# EAGLE design zedAF (EAGLE 9.4.2)

## Sheet 1 of 2
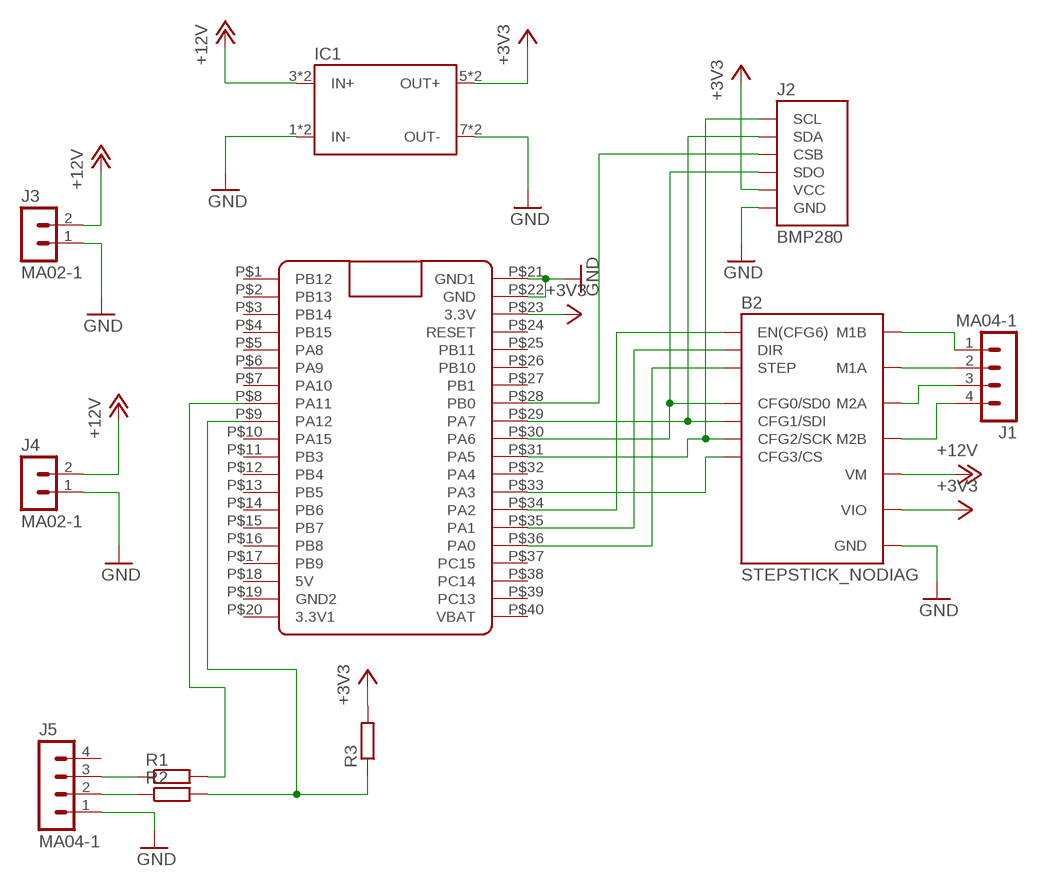
[diagram p0: schematic, sheet 1]

### Parts
B2  STEPSTICK_NODIAG  [STEPSTICK]
IC1  DC/DCDC  [DC/DC]
J1  MA04-1  [MA04-1]
J2  BMP280  [BMP280-1X6]
J3  MA02-1  [MA02-1]
J4  MA02-1  [MA02-1]
J5  MA04-1  [MA04-1]
R1  R-EU_R1206  [R1206]
R2  R-EU_R1206  [R1206]
R3  R-EU_R1206  [R1206]
U$1  BLUE_PILLWIDE  [BLUE_PILL_WIDE]

### Nets
+3V3: B2.VIO IC1.5(OUT+) IC1.6(OUT+) J2.1(VCC) R3.2 U$1.P$23(3.3V)
+12V: B2.VM IC1.3(IN+) IC1.4(IN+) J3.2 J4.2
GND: B2.GND@1(GND) B2.GND@2(GND) IC1.1(IN-) IC1.2(IN-) IC1.7(OUT-) IC1.8(OUT-) J2.2(GND) J3.1 J4.1 J5.1 U$1.P$21(GND1) U$1.P$22(GND)
N$1: B2.M1B J1.1
N$2: B2.M1A J1.2
N$3: B2.M2A J1.3
N$4: B2.M2B J1.4
N$5: B2.CFG1(CFG1/SDI) J2.4(SDA) U$1.P$29(PA7)
N$6: B2.NC/CFG0(CFG0/SD0) J2.6(SDO) U$1.P$30(PA6)
N$7: B2.CFG2(CFG2/SCK) J2.3(SCL) U$1.P$31(PA5)
N$8: B2.CFG3(CFG3/CS) U$1.P$33(PA3)
N$9: B2.EN(EN(CFG6)) U$1.P$34(PA2)
N$10: B2.DIR U$1.P$35(PA1)
N$11: B2.STEP U$1.P$36(PA0)
N$12: J2.5(CSB) U$1.P$28(PB0)
N$13: J5.3 R1.1
N$14: J5.2 R2.1
N$15: R2.2 R3.1 U$1.P$9(PA12)
N$16: R1.2 U$1.P$8(PA11)
Unconnected: J5.4 U$1.P$1(PB12) U$1.P$2(PB13) U$1.P$3(PB14) U$1.P$4(PB15) U$1.P$5(PA8) U$1.P$6(PA9) U$1.P$7(PA10) U$1.P$10(PA15) U$1.P$11(PB3) U$1.P$12(PB4) U$1.P$13(PB5) U$1.P$14(PB6) U$1.P$15(PB7) U$1.P$16(PB8) U$1.P$17(PB9) U$1.P$18(5V) U$1.P$19(GND2) U$1.P$20(3.3V1) U$1.P$24(RESET) U$1.P$25(PB11) U$1.P$26(PB10) U$1.P$27(PB1) U$1.P$32(PA4) U$1.P$37(PC15) U$1.P$38(PC14) U$1.P$39(PC13) U$1.P$40(VBAT)

## Sheet 2 of 2

## Library data of the parts
B2 = we-board:STEPSTICK_NODIAG: SilentStepStick - Trinamic TMC2100/TMC2130 Stepper Motor Driver TMC2100 - CFG pins for configuration TMC2130 - SPI for configuration Pin CFG0/SDO only available on TMC2130 SilentStepStick.
IC1 = we-power:DC/DC: DC/DC Converter from Meanwell / Recom
J1 J5 = we-con:MA04-1: Pin Header
J2 = we-board:BMP280: AVR ISP connector
J3 J4 = we-con:MA02-1: Pin Header
R1-R3 = rcl:R-EU_: RESISTOR, European symbol; SPICEPREFIX: R
U$1 = BluePill:BLUE_PILL

## Board
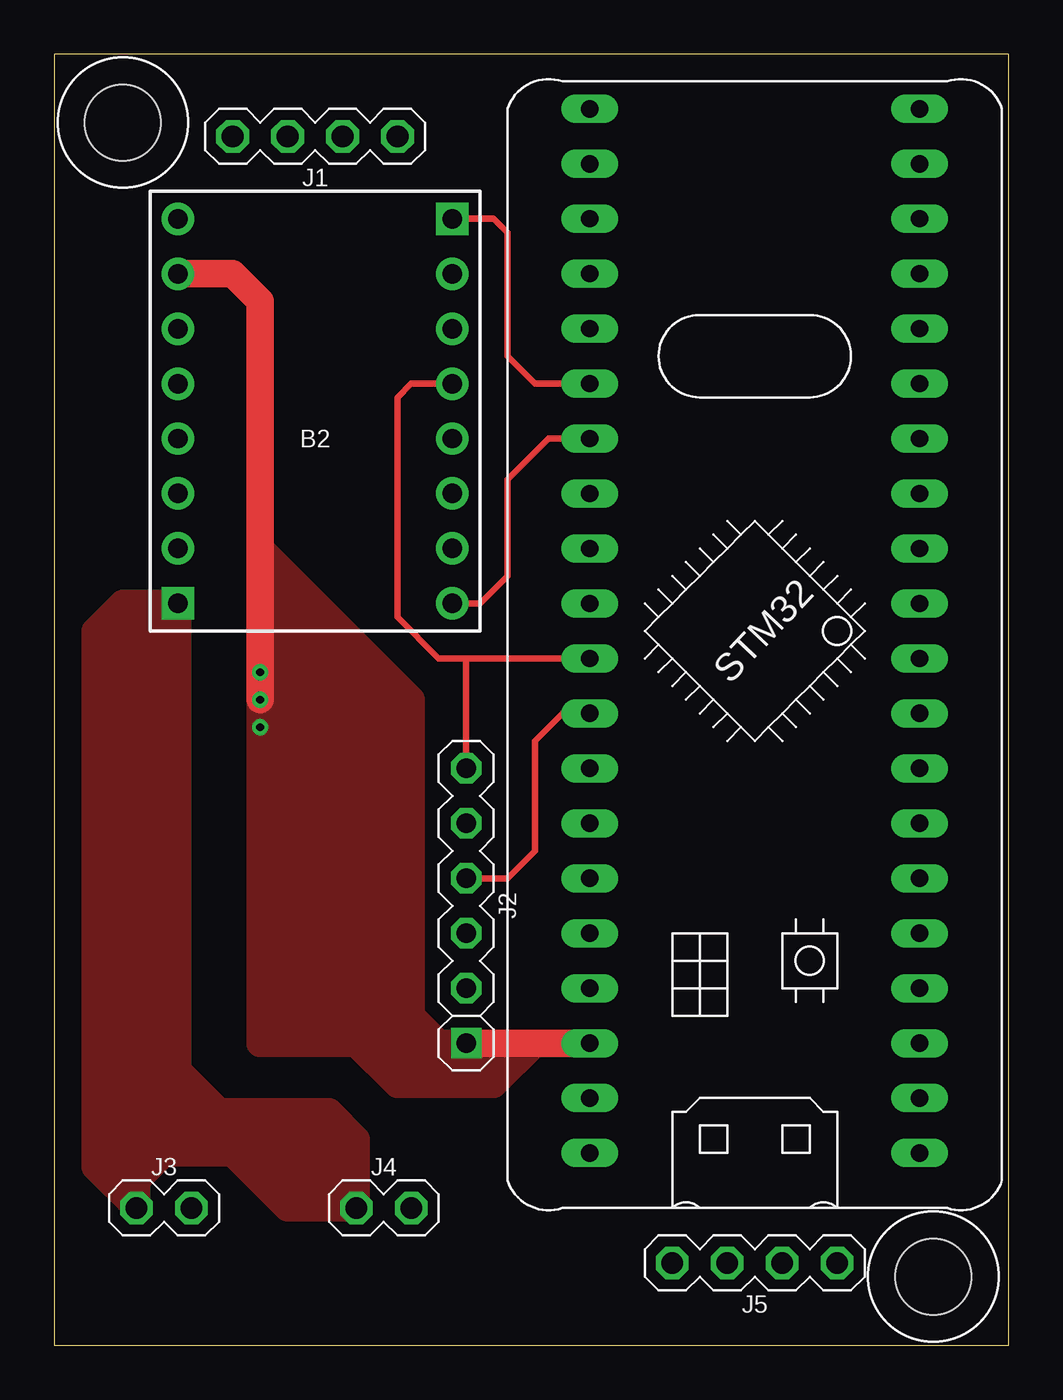
[diagram p1: board, top side]
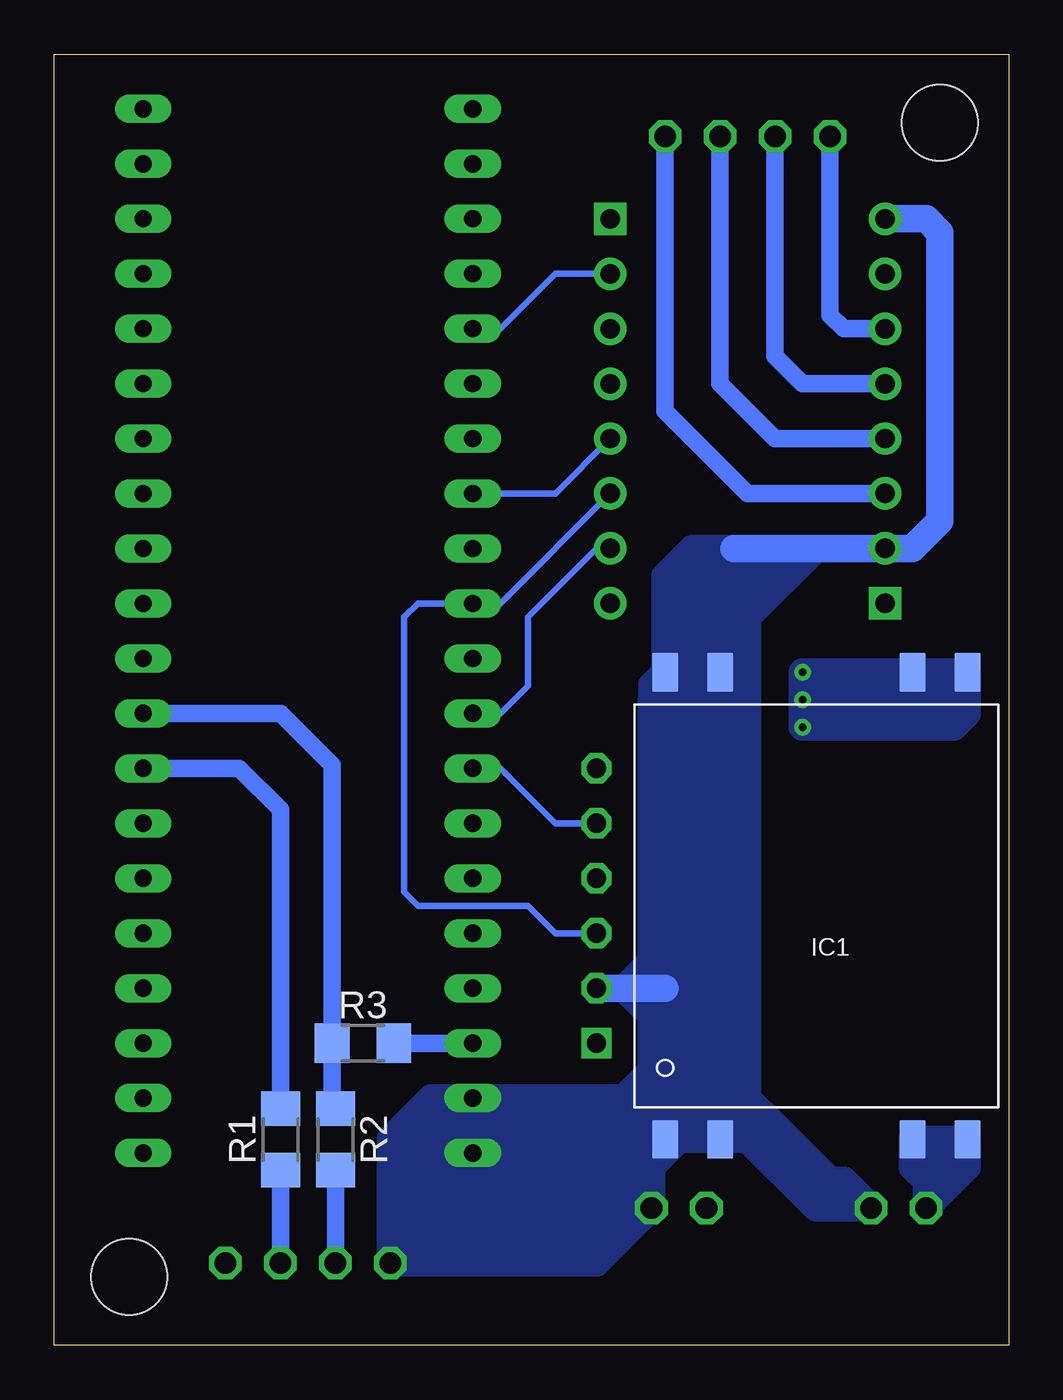
[diagram p2: board, bottom side, seen from below]

Size 44.12 x 59.68 mm. Coordinates in mm from the lower left corner, seen from the top.
Outline: 0,0 44.12,0 44.12,59.68 0,59.68 0,0
Copper layers (1*16): Top 0.035mm / dielectric 1.5mm / Bottom 0.035mm
Design rules "default": minimum track width 6mil, minimum drill 0.35mm, track to track 6mil, track to pad 6mil, pad to pad 6mil, via to via 6mil, smd to smd 6mil, copper to edge 40mil, drill to drill 6mil, minimum pad ring 10mil, minimum via ring 8mil, stop-mask expansion 4mil, vias tented up to drill 0mil, thermal gap 10mil
Holes 3.5 mm at 3.18,56.52 40.64,3.17

### Footprints (pad centres in the part's own frame; a part is rotated, then mirrored left to right if it is on the bottom)
STEPSTICK = drill 0.9 pad 1.5: CFG1 -6.35,6.35; CFG2 -6.35,3.81; CFG3 -6.35,1.27; EN -6.35,8.89; GND@1 6.35,6.35; GND@2 6.35,-8.89; M1A 6.35,-1.27; M1B 6.35,-3.81; M2A 6.35,1.27; M2B 6.35,3.81; NC -6.35,-3.81; NC/CFG0 -6.35,-1.27; STEP -6.35,-6.35; VIO 6.35,-6.35 | drill 0.9 pad 1.5 square: DIR -6.35,-8.89; VM 6.35,8.89
DC/DC = smd 1.8 x 1.2: 1 -10.16,7.62; 2 -10.16,5.08; 3 -10.16,-3.81; 4 -10.16,-6.35; 5 11.43,-6.35; 6 11.43,-3.81; 7 11.43,5.08; 8 11.43,7.62
MA04-1 = drill 1 octagon: 1 0,3.81; 2 0,1.27; 3 0,-1.27; 4 0,-3.81
BMP280-1X6 = drill 0.9 pad 1.4 square: 1 0,6.35 | drill 0.9 pad 1.4 octagon: 2 0,3.81; 3 0,1.27; 4 0,-1.27; 5 0,-3.81; 6 0,-6.35
MA02-1 = drill 1 octagon: 1 0,1.27; 2 0,-1.27
R1206 = smd 1.6 x 1.803: 1 -1.422,0; 2 1.422,0
BLUE_PILL_WIDE = drill 0.8 long: P$1 -7.62,15.24; P$2 -7.62,12.7; P$3 -7.62,10.16; P$4 -7.62,7.62; P$5 -7.62,5.08; P$6 -7.62,2.54; P$7 -7.62,0; P$8 -7.62,-2.54; P$9 -7.62,-5.08; P$10 -7.62,-7.62; P$11 -7.62,-10.16; P$12 -7.62,-12.7; P$13 -7.62,-15.24; P$14 -7.62,-17.78; P$15 -7.62,-20.32; P$16 -7.62,-22.86; P$17 -7.62,-25.4; P$18 -7.62,-27.94; P$19 -7.62,-30.48; P$20 -7.62,-33.02; P$21 7.62,15.24; P$22 7.62,12.7; P$23 7.62,10.16; P$24 7.62,7.62; P$25 7.62,5.08; P$26 7.62,2.54; P$27 7.62,0; P$28 7.62,-2.54; P$29 7.62,-5.08; P$30 7.62,-7.62; P$31 7.62,-10.16; P$32 7.62,-12.7; P$33 7.62,-15.24; P$34 7.62,-17.78; P$35 7.62,-20.32; P$36 7.62,-22.86; P$37 7.62,-25.4; P$38 7.62,-27.94; P$39 7.62,-30.48; P$40 7.62,-33.02

### Placement (x,y rotation side)
B2  12.07,43.18 180 top
IC1  8.25,19.69 90 bottom
J1  12.07,55.88 90 top
J2  19.05,20.32 180 top
J3  5.08,6.35 270 top
J4  15.24,6.35 270 top
J5  32.39,3.81 90 top
R1  33.66,9.53 90 bottom
R2  31.11,9.53 90 bottom
R3  29.85,13.97 0 bottom
U$1  32.39,24.13 180 top

### Tracks (layer width: path | path; a pad name or v marks a point on that pad's centre or on a via)
+3V3  (via drill 0.35)
  Top 1.27: v9.53,29.84 v9.53,31.12 9.53,48.26 8.25,49.53 B2.VIO | U$1.P$23 J2.1
  Bottom 0.813: R3.2 U$1.P$23
  other vias: 9.53,28.58
  pour Top (no thermals): 9.53,29.84 16.51,29.84 16.51,14.22 16.76,13.97 9.53,13.97
  pour Top (no thermals): 16.51,29.84 9.53,36.83 9.53,29.84
  pour Top (no thermals): 9.53,13.97 13.97,13.97 15.88,12.06 20.32,12.06 22.23,13.97 17.78,13.97 16.51,15.24 10.79,15.24
  pour Bottom (no thermals): 1.91,31.12 9.53,31.12 9.53,28.58 2.54,28.58 1.91,29.21
+12V
  pour Bottom (no thermals): 3.81,6.35 1.91,8.26 1.91,9.53 4.45,9.53 4.45,8.26 3.81,7.62
  pour Top (no thermals): 13.97,6.35 13.97,9.53 12.7,10.79 7.62,10.79 6.35,12.06 5.71,12.7 5.71,34.29 3.18,34.29 1.91,33.02 1.91,8.26 3.81,6.35 3.81,7.62 5.08,8.89 8.25,8.89 10.79,6.35
GND
  Bottom 1.27: 12.7,36.83 B2.GND@1 4.45,36.83 3.18,38.1 3.18,51.44 3.81,52.07 B2.GND@2 | J2.2 15.88,16.51
  pour Bottom (no thermals): 16.51,29.84 16.51,10.79 12.07,10.79 12.07,29.84
  pour Bottom (no thermals): 24.77,8.89 24.77,11.43 17.78,11.43 16.51,12.7 14.61,10.79 13.97,10.79 16.51,8.26 16.51,6.98 23.5,6.98 24.77,8.26
  pour Bottom (no thermals): 6.35,6.35 8.89,6.35 12.07,9.53 15.88,9.53 15.88,12.7 14.61,13.97 8.25,7.62 7.62,7.62
  pour Bottom (no thermals): 12.07,29.84 12.07,33.66 8.89,36.83 14.61,36.83 15.88,35.56 15.88,31.12 16.51,30.48 16.51,29.84
  pour Bottom (no thermals): 17.78,16.51 16.51,17.78 16.51,15.24
  pour Bottom (no thermals): 24.13,11.43 26.67,11.43 27.94,10.16 28.57,9.53 28.57,3.81 19.05,3.81 16.51,6.35 21.59,11.43
N$1
  Bottom 0.813: B2.M1B 7.62,46.99 8.25,47.62 J1.1
N$2
  Bottom 0.813: B2.M1A 9.53,44.45 10.79,45.72 J1.2
N$3
  Bottom 0.813: B2.M2A 10.79,41.91 13.34,44.45 J1.3
N$4
  Bottom 0.813: B2.M2B 12.07,39.37 15.88,43.18 J1.4
N$5
  Top 0.305: U$1.P$29 23.5,29.21 22.23,27.94 22.23,22.86 20.96,21.59 J2.4
  Bottom 0.305: B2.CFG1 19.05,36.83 22.23,33.66 22.23,30.48 23.5,29.21 U$1.P$29
N$6
  Top 0.305: J2.6 19.05,31.75 | 19.05,31.75 U$1.P$30 | B2.NC/CFG0 16.51,44.45 15.88,43.81 15.88,33.66 17.78,31.75 19.05,31.75
N$7
  Bottom 0.305: B2.CFG2 23.5,34.29 U$1.P$31 27.31,34.29 27.94,33.66 27.94,20.95 27.31,20.32 22.23,20.32 20.96,19.05 J2.3
N$8
  Bottom 0.305: B2.CFG3 20.96,39.37 U$1.P$33
N$9
  Top 0.305: B2.EN 19.68,34.29 20.96,35.56 20.96,40.01 22.86,41.91 U$1.P$34
N$10
  Top 0.305: B2.DIR 20.32,52.07 20.96,51.44 20.96,45.72 22.23,44.45 U$1.P$35
N$11
  Bottom 0.305: B2.STEP 20.96,49.53 23.5,46.99 U$1.P$36
N$12
  Bottom 0.305: U$1.P$28 23.5,26.67 20.96,24.13 J2.5
N$13
  Bottom 0.813: J5.3 R1.1
N$14
  Bottom 0.813: J5.2 R2.1
N$15
  Bottom 0.813: 30.79,10.79 R2.2 31.27,11.1 R3.1 31.27,26.82 31.43,26.98 33.66,29.21 U$1.P$9
N$16
  Bottom 0.813: R1.2 33.66,24.77 35.56,26.67 U$1.P$8